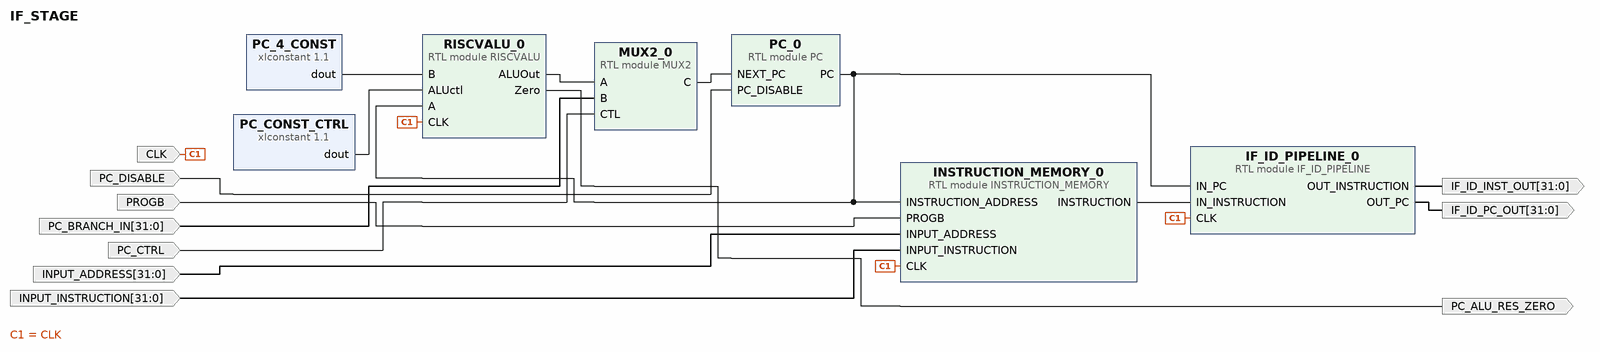
[diagram p0: block diagram of the top level]
# Vivado block design IF_STAGE, xc7z020clg400-1, Vivado 2020.2
create_bd_design IF_STAGE

create_bd_port -dir I PC_DISABLE
create_bd_port -dir I -type clk CLK
create_bd_port -dir I PROGB
create_bd_port -dir I -from 31 -to 0 INPUT_ADDRESS
create_bd_port -dir I -from 31 -to 0 INPUT_INSTRUCTION
create_bd_port -dir I -from 31 -to 0 PC_BRANCH_IN
create_bd_port -dir I PC_CTRL
create_bd_port -dir O -from 31 -to 0 IF_ID_PC_OUT
create_bd_port -dir O -from 31 -to 0 IF_ID_INST_OUT
create_bd_port -dir O PC_ALU_RES_ZERO

create_bd_cell -type module -reference PC PC_0
create_bd_cell -type module -reference RISCVALU RISCVALU_0
create_bd_cell -type ip -vlnv xilinx.com:ip:xlconstant:1.1 PC_4_CONST
set_property -dict {CONFIG.CONST_VAL 4 CONFIG.CONST_WIDTH 32} [get_bd_cells PC_4_CONST]
create_bd_cell -type ip -vlnv xilinx.com:ip:xlconstant:1.1 PC_CONST_CTRL
set_property -dict {CONFIG.CONST_VAL 2 CONFIG.CONST_WIDTH 4} [get_bd_cells PC_CONST_CTRL]
create_bd_cell -type module -reference MUX2 MUX2_0
create_bd_cell -type module -reference IF_ID_PIPELINE IF_ID_PIPELINE_0
create_bd_cell -type module -reference INSTRUCTION_MEMORY INSTRUCTION_MEMORY_0

# ---- connections ----

connect_bd_net -net PC_DISABLE_0_1 [get_bd_ports PC_DISABLE] [get_bd_pins PC_0/PC_DISABLE]
connect_bd_net -net CLK_0_1 [get_bd_ports CLK] [get_bd_pins RISCVALU_0/CLK] [get_bd_pins IF_ID_PIPELINE_0/CLK] [get_bd_pins INSTRUCTION_MEMORY_0/CLK]
connect_bd_net [get_bd_pins PC_0/PC] \
  [get_bd_pins RISCVALU_0/A] [get_bd_pins IF_ID_PIPELINE_0/IN_PC] [get_bd_pins INSTRUCTION_MEMORY_0/INSTRUCTION_ADDRESS]
connect_bd_net -net PROGB_0_1 [get_bd_ports PROGB] [get_bd_pins INSTRUCTION_MEMORY_0/PROGB]
connect_bd_net -net INPUT_ADDRESS_0_1 [get_bd_ports INPUT_ADDRESS] [get_bd_pins INSTRUCTION_MEMORY_0/INPUT_ADDRESS]
connect_bd_net -net INPUT_INSTRUCTION_0_1 [get_bd_ports INPUT_INSTRUCTION] [get_bd_pins INSTRUCTION_MEMORY_0/INPUT_INSTRUCTION]
connect_bd_net -net xlconstant_0_dout [get_bd_pins PC_4_CONST/dout] [get_bd_pins RISCVALU_0/B]
connect_bd_net -net PC_4_CONST1_dout [get_bd_pins PC_CONST_CTRL/dout] [get_bd_pins RISCVALU_0/ALUctl]
connect_bd_net [get_bd_pins RISCVALU_0/ALUOut] [get_bd_pins MUX2_0/A]
connect_bd_net -net B_0_1 [get_bd_ports PC_BRANCH_IN] [get_bd_pins MUX2_0/B]
connect_bd_net -net CTL_0_1 [get_bd_ports PC_CTRL] [get_bd_pins MUX2_0/CTL]
connect_bd_net [get_bd_pins MUX2_0/C] [get_bd_pins PC_0/NEXT_PC]
connect_bd_net [get_bd_pins INSTRUCTION_MEMORY_0/INSTRUCTION] [get_bd_pins IF_ID_PIPELINE_0/IN_INSTRUCTION]
connect_bd_net [get_bd_pins IF_ID_PIPELINE_0/OUT_PC] [get_bd_ports IF_ID_PC_OUT]
connect_bd_net [get_bd_pins IF_ID_PIPELINE_0/OUT_INSTRUCTION] [get_bd_ports IF_ID_INST_OUT]
connect_bd_net [get_bd_pins RISCVALU_0/Zero] [get_bd_ports PC_ALU_RES_ZERO]

validate_bd_design
save_bd_design
